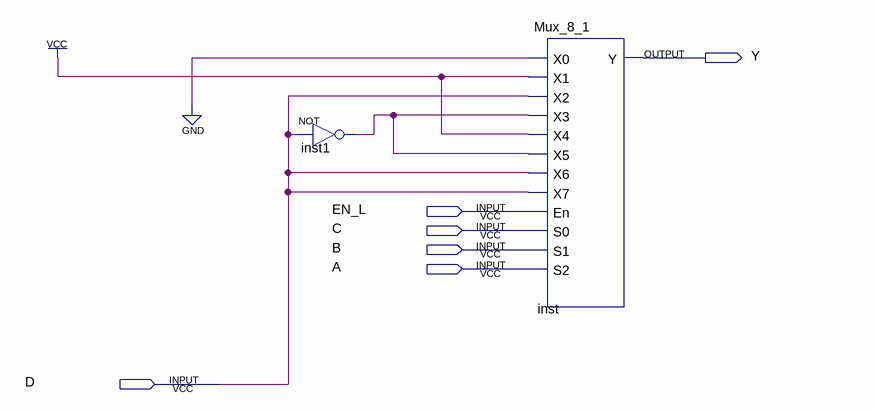
[diagram p0: schematic sheet]
// Quartus schematic Bool_func.bdf as structural Verilog: 2 symbols, 6 pins
module Bool_func (
  input  EN_L,
  input  C,
  input  B,
  input  A,
  input  D,
  output Y
);

  wire inst1_out;

  not inst1 (inst1_out, D);
  Mux_8_1 inst (
    .X0(1'b0), .X1(1'b1), .X2(D), .X3(inst1_out), .X4(1'b1), .X5(inst1_out), .X6(D), .X7(D), .En(EN_L),
    .S0(C), .S1(B), .S2(A), .Y(Y));
endmodule
